# Altium schematic sheet PWR_CPU.SchDoc
size 420 x 297 mm; Scale: 1:1; DocumentType: Схема электрическая принципиальная; SheetNumber: 8; SheetTotal: 32; DocumentTypeShort: Э3; DocumentInvertoryNumber: ㅤ
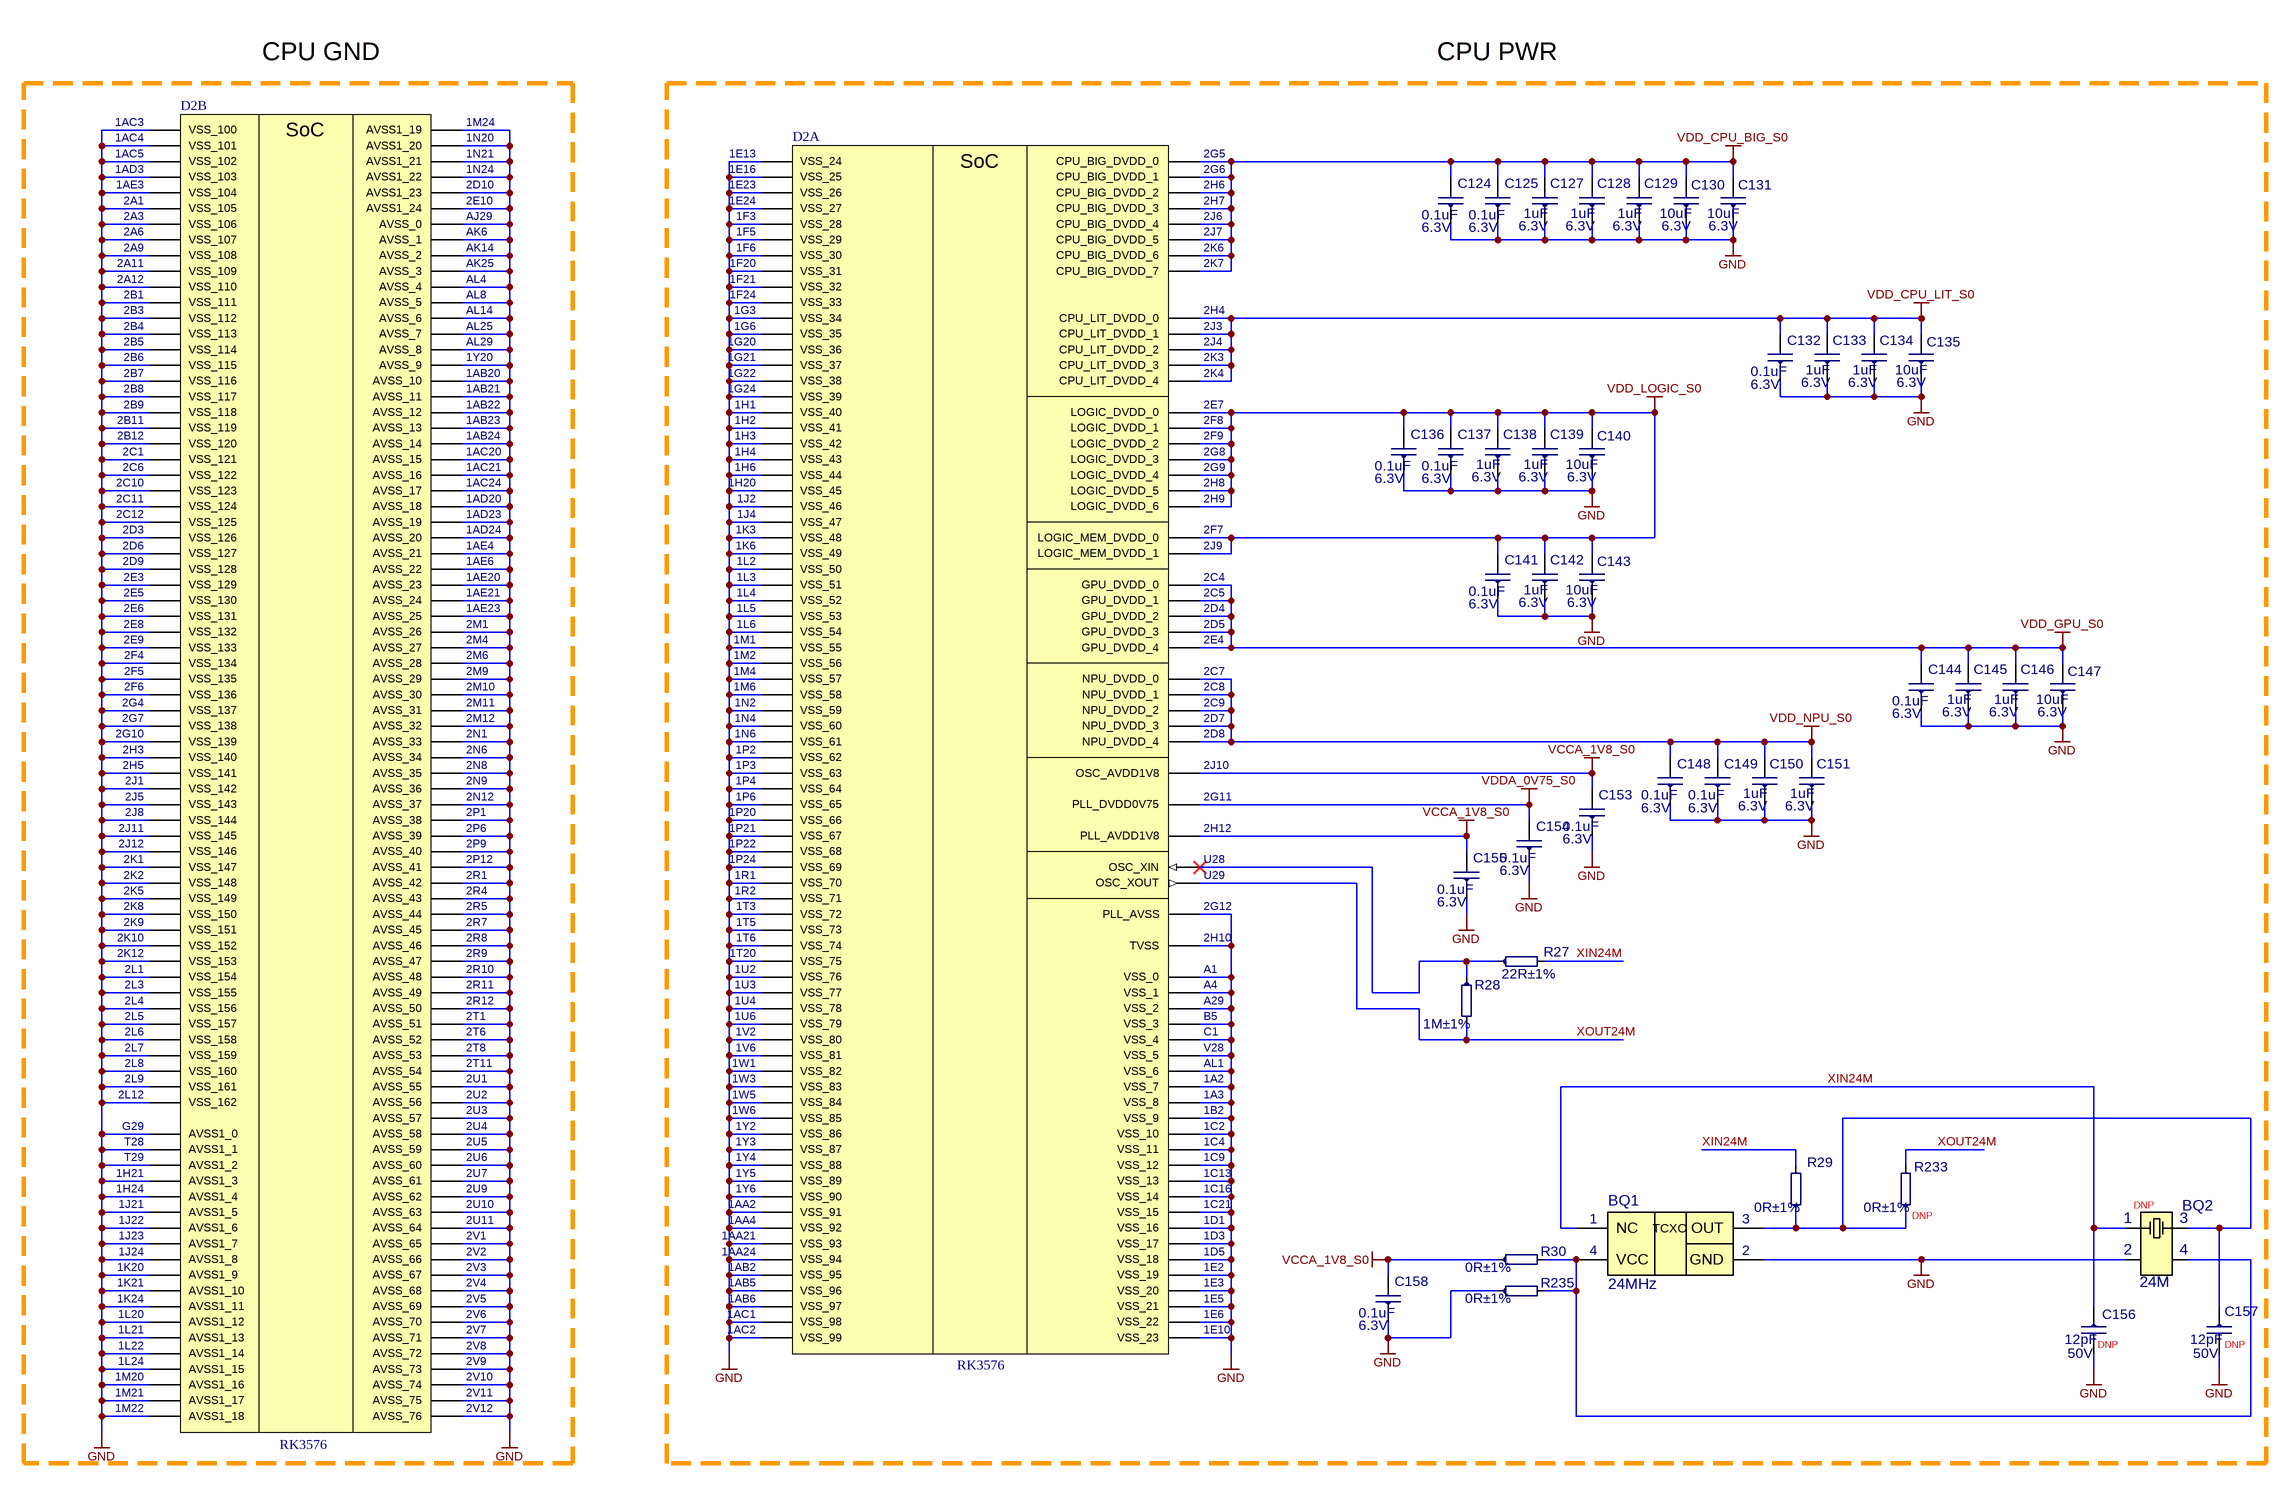
[diagram p0: PWR_CPU.SchDoc]

## Parts
BQ1  24MHz  [TC32S4-24.000-0618NQDTN]
BQ2  24M  [NX3225GA]
C124  0.1uF  Voltage: 6.3V  [C0201]
C125  0.1uF  Voltage: 6.3V  [C0201]
C127  1uF  Voltage: 6.3V  [C0201]
C128  1uF  Voltage: 6.3V  [C0201]
C129  1uF  Voltage: 6.3V  [C0201]
C130  10uF  Voltage: 6.3V  [C0402]
C131  10uF  Voltage: 6.3V  [C0402]
C132  0.1uF  Voltage: 6.3V  [C0201]
C133  1uF  Voltage: 6.3V  [C0201]
C134  1uF  Voltage: 6.3V  [C0201]
C135  10uF  Voltage: 6.3V  [C0402]
C136  0.1uF  Voltage: 6.3V  [C0201]
C137  0.1uF  Voltage: 6.3V  [C0201]
C138  1uF  Voltage: 6.3V  [C0201]
C139  1uF  Voltage: 6.3V  [C0201]
C140  10uF  Voltage: 6.3V  [C0402]
C141  0.1uF  Voltage: 6.3V  [C0201]
C142  1uF  Voltage: 6.3V  [C0201]
C143  10uF  Voltage: 6.3V  [C0402]
C144  0.1uF  Voltage: 6.3V  [C0201]
C145  1uF  Voltage: 6.3V  [C0201]
C146  1uF  Voltage: 6.3V  [C0201]
C147  10uF  Voltage: 6.3V  [C0402]
C148  0.1uF  Voltage: 6.3V  [C0201]
C149  0.1uF  Voltage: 6.3V  [C0201]
C150  1uF  Voltage: 6.3V  [C0201]
C151  1uF  Voltage: 6.3V  [C0201]
C153  0.1uF  Voltage: 6.3V  [C0201]
C154  0.1uF  Voltage: 6.3V  [C0201]
C155  0.1uF  Voltage: 6.3V  [C0201]
C156  12pF  Voltage: 50V  [C0402]
C157  12pF  Voltage: 50V  [C0402]
C158  0.1uF  Voltage: 6.3V  [C0201]
D2  RK3576  [BGAFCCSP698L]  (parts A,B of 7)
R27  22R±1%  [R0402]
R28  1M±1%  [R0402]
R29  0R±1%  [R0402]
R30  0R±1%  [R0402]
R233  0R±1%  [R0402]
R235  0R±1%  [R0402]

## Nets
GND: BQ1.2(GND) BQ2.2 C124.1 C125.1 C127.1 C128.1 C129.1 C130.1 C131.1 C132.1 C133.1 C134.1 C135.1 C136.1 C137.1 C138.1 C139.1 C140.1 C141.1 C142.1 C143.1 C144.1 C145.1 C146.1 C147.1 C148.1 C149.1 C150.1 C151.1 C153.1 C154.1 C155.1 C156.2 C157.2 C158.1 D2.1A2(VSS_7) D2.1A3(VSS_8) D2.1AA2(VSS_91) D2.1AA4(VSS_92) D2.1AA21(VSS_93) D2.1AA24(VSS_94) D2.1AB2(VSS_95) D2.1AB5(VSS_96) D2.1AB6(VSS_97) D2.1AB20(AVSS_10) D2.1AB21(AVSS_11) D2.1AB22(AVSS_12) D2.1AB23(AVSS_13) D2.1AB24(AVSS_14) D2.1AC1(VSS_98) D2.1AC2(VSS_99) D2.1AC3(VSS_100) D2.1AC4(VSS_101) D2.1AC5(VSS_102) D2.1AC20(AVSS_15) D2.1AC21(AVSS_16) D2.1AC24(AVSS_17) D2.1AD3(VSS_103) D2.1AD20(AVSS_18) D2.1AD23(AVSS_19) D2.1AD24(AVSS_20) D2.1AE3(VSS_104) D2.1AE4(AVSS_21) D2.1AE6(AVSS_22) D2.1AE20(AVSS_23) D2.1AE21(AVSS_24) D2.1AE23(AVSS_25) D2.1B2(VSS_9) D2.1C2(VSS_10) D2.1C4(VSS_11) D2.1C9(VSS_12) D2.1C13(VSS_13) D2.1C16(VSS_14) D2.1C21(VSS_15) D2.1D1(VSS_16) D2.1D3(VSS_17) D2.1D5(VSS_18) D2.1E2(VSS_19) D2.1E3(VSS_20) D2.1E5(VSS_21) D2.1E6(VSS_22) D2.1E10(VSS_23) D2.1E13(VSS_24) D2.1E16(VSS_25) D2.1E23(VSS_26) D2.1E24(VSS_27) D2.1F3(VSS_28) D2.1F5(VSS_29) D2.1F6(VSS_30) D2.1F20(VSS_31) D2.1F21(VSS_32) D2.1F24(VSS_33) D2.1G3(VSS_34) D2.1G6(VSS_35) D2.1G20(VSS_36) D2.1G21(VSS_37) D2.1G22(VSS_38) D2.1G24(VSS_39) D2.1H1(VSS_40) D2.1H2(VSS_41) D2.1H3(VSS_42) D2.1H4(VSS_43) D2.1H6(VSS_44) D2.1H20(VSS_45) D2.1H21(AVSS1_3) D2.1H24(AVSS1_4) D2.1J2(VSS_46) D2.1J4(VSS_47) D2.1J21(AVSS1_5) D2.1J22(AVSS1_6) D2.1J23(AVSS1_7) D2.1J24(AVSS1_8) D2.1K3(VSS_48) D2.1K6(VSS_49) D2.1K20(AVSS1_9) D2.1K21(AVSS1_10) D2.1K24(AVSS1_11) D2.1L2(VSS_50) D2.1L3(VSS_51) D2.1L4(VSS_52) D2.1L5(VSS_53) D2.1L6(VSS_54) D2.1L20(AVSS1_12) D2.1L21(AVSS1_13) D2.1L22(AVSS1_14) D2.1L24(AVSS1_15) D2.1M1(VSS_55) D2.1M2(VSS_56) D2.1M4(VSS_57) D2.1M6(VSS_58) D2.1M20(AVSS1_16) D2.1M21(AVSS1_17) D2.1M22(AVSS1_18) D2.1M24(AVSS1_19) D2.1N2(VSS_59) D2.1N4(VSS_60) D2.1N6(VSS_61) D2.1N20(AVSS1_20) D2.1N21(AVSS1_21) D2.1N24(AVSS1_22) D2.1P2(VSS_62) D2.1P3(VSS_63) D2.1P4(VSS_64) D2.1P6(VSS_65) D2.1P20(VSS_66) D2.1P21(VSS_67) D2.1P22(VSS_68) D2.1P24(VSS_69) D2.1R1(VSS_70) D2.1R2(VSS_71) D2.1T3(VSS_72) D2.1T5(VSS_73) D2.1T6(VSS_74) D2.1T20(VSS_75) D2.1U2(VSS_76) D2.1U3(VSS_77) D2.1U4(VSS_78) D2.1U6(VSS_79) D2.1V2(VSS_80) D2.1V6(VSS_81) D2.1W1(VSS_82) D2.1W3(VSS_83) D2.1W5(VSS_84) D2.1W6(VSS_85) D2.1Y2(VSS_86) D2.1Y3(VSS_87) D2.1Y4(VSS_88) D2.1Y5(VSS_89) D2.1Y6(VSS_90) D2.1Y20(AVSS_9) D2.2A1(VSS_105) D2.2A3(VSS_106) D2.2A6(VSS_107) D2.2A9(VSS_108) D2.2A11(VSS_109) D2.2A12(VSS_110) D2.2B1(VSS_111) D2.2B3(VSS_112) D2.2B4(VSS_113) D2.2B5(VSS_114) D2.2B6(VSS_115) D2.2B7(VSS_116) D2.2B8(VSS_117) D2.2B9(VSS_118) D2.2B11(VSS_119) D2.2B12(VSS_120) D2.2C1(VSS_121) D2.2C6(VSS_122) D2.2C10(VSS_123) D2.2C11(VSS_124) D2.2C12(VSS_125) D2.2D3(VSS_126) D2.2D6(VSS_127) D2.2D9(VSS_128) D2.2D10(AVSS1_23) D2.2E3(VSS_129) D2.2E5(VSS_130) D2.2E6(VSS_131) D2.2E8(VSS_132) D2.2E9(VSS_133) D2.2E10(AVSS1_24) D2.2F4(VSS_134) D2.2F5(VSS_135) D2.2F6(VSS_136) D2.2G4(VSS_137) D2.2G7(VSS_138) D2.2G10(VSS_139) D2.2G12(PLL_AVSS) D2.2H3(VSS_140) D2.2H5(VSS_141) D2.2H10(TVSS) D2.2J1(VSS_142) D2.2J5(VSS_143) D2.2J8(VSS_144) D2.2J11(VSS_145) D2.2J12(VSS_146) D2.2K1(VSS_147) D2.2K2(VSS_148) D2.2K5(VSS_149) D2.2K8(VSS_150) D2.2K9(VSS_151) D2.2K10(VSS_152) D2.2K12(VSS_153) D2.2L1(VSS_154) D2.2L3(VSS_155) D2.2L4(VSS_156) D2.2L5(VSS_157) D2.2L6(VSS_158) D2.2L7(VSS_159) D2.2L8(VSS_160) D2.2L9(VSS_161) D2.2L12(VSS_162) D2.2M1(AVSS_26) D2.2M4(AVSS_27) D2.2M6(AVSS_28) D2.2M9(AVSS_29) D2.2M10(AVSS_30) D2.2M11(AVSS_31) D2.2M12(AVSS_32) D2.2N1(AVSS_33) D2.2N6(AVSS_34) D2.2N8(AVSS_35) D2.2N9(AVSS_36) D2.2N12(AVSS_37) D2.2P1(AVSS_38) D2.2P6(AVSS_39) D2.2P9(AVSS_40) D2.2P12(AVSS_41) D2.2R1(AVSS_42) D2.2R4(AVSS_43) D2.2R5(AVSS_44) D2.2R7(AVSS_45) D2.2R8(AVSS_46) D2.2R9(AVSS_47) D2.2R10(AVSS_48) D2.2R11(AVSS_49) D2.2R12(AVSS_50) D2.2T1(AVSS_51) D2.2T6(AVSS_52) D2.2T8(AVSS_53) D2.2T11(AVSS_54) D2.2U1(AVSS_55) D2.2U2(AVSS_56) D2.2U3(AVSS_57) D2.2U4(AVSS_58) D2.2U5(AVSS_59) D2.2U6(AVSS_60) D2.2U7(AVSS_61) D2.2U9(AVSS_62) D2.2U10(AVSS_63) D2.2U11(AVSS_64) D2.2V1(AVSS_65) D2.2V2(AVSS_66) D2.2V3(AVSS_67) D2.2V4(AVSS_68) D2.2V5(AVSS_69) D2.2V6(AVSS_70) D2.2V7(AVSS_71) D2.2V8(AVSS_72) D2.2V9(AVSS_73) D2.2V10(AVSS_74) D2.2V11(AVSS_75) D2.2V12(AVSS_76) D2.A1(VSS_0) D2.A4(VSS_1) D2.A29(VSS_2) D2.AJ29(AVSS_0) D2.AK6(AVSS_1) D2.AK14(AVSS_2) D2.AK25(AVSS_3) D2.AL1(VSS_6) D2.AL4(AVSS_4) D2.AL8(AVSS_5) D2.AL14(AVSS_6) D2.AL25(AVSS_7) D2.AL29(AVSS_8) D2.B5(VSS_3) D2.C1(VSS_4) D2.G29(AVSS1_0) D2.T28(AVSS1_1) D2.T29(AVSS1_2) D2.V28(VSS_5) R235.1
VCCA_1V8_S0: C153.2 C155.2 C158.2 D2.2H12(PLL_AVDD1V8) D2.2J10(OSC_AVDD1V8) R30.1
VDD_CPU_BIG_S0: C124.2 C125.2 C127.2 C128.2 C129.2 C130.2 C131.2 D2.2G5(CPU_BIG_DVDD_0) D2.2G6(CPU_BIG_DVDD_1) D2.2H6(CPU_BIG_DVDD_2) D2.2H7(CPU_BIG_DVDD_3) D2.2J6(CPU_BIG_DVDD_4) D2.2J7(CPU_BIG_DVDD_5) D2.2K6(CPU_BIG_DVDD_6) D2.2K7(CPU_BIG_DVDD_7)
VDD_CPU_LIT_S0: C132.2 C133.2 C134.2 C135.2 D2.2H4(CPU_LIT_DVDD_0) D2.2J3(CPU_LIT_DVDD_1) D2.2J4(CPU_LIT_DVDD_2) D2.2K3(CPU_LIT_DVDD_3) D2.2K4(CPU_LIT_DVDD_4)
VDD_GPU_S0: C144.2 C145.2 C146.2 C147.2 D2.2C4(GPU_DVDD_0) D2.2C5(GPU_DVDD_1) D2.2D4(GPU_DVDD_2) D2.2D5(GPU_DVDD_3) D2.2E4(GPU_DVDD_4)
VDD_LOGIC_S0: C136.2 C137.2 C138.2 C139.2 C140.2 C141.2 C142.2 C143.2 D2.2E7(LOGIC_DVDD_0) D2.2F7(LOGIC_MEM_DVDD_0) D2.2F8(LOGIC_DVDD_1) D2.2F9(LOGIC_DVDD_2) D2.2G8(LOGIC_DVDD_3) D2.2G9(LOGIC_DVDD_4) D2.2H8(LOGIC_DVDD_5) D2.2H9(LOGIC_DVDD_6) D2.2J9(LOGIC_MEM_DVDD_1)
VDD_NPU_S0: C148.2 C149.2 C150.2 C151.2 D2.2C7(NPU_DVDD_0) D2.2C8(NPU_DVDD_1) D2.2C9(NPU_DVDD_2) D2.2D7(NPU_DVDD_3) D2.2D8(NPU_DVDD_4)
VDDA_0V75_S0: C154.2 D2.2G11(PLL_DVDD0V75)
XIN24M: BQ1.1(NC) BQ2.1 C156.1 R27.2 R29.2
XOUT24M: D2.U29(OSC_XOUT) R28.2 R233.2
NetBQ1_3: BQ1.3(OUT) BQ2.3 C157.1 R29.1 R233.1
NetBQ1_4: BQ1.4(VCC) BQ2.4 R30.2 R235.2
NetD2_U28: D2.U28(OSC_XIN) R27.1 R28.1

## Notes on the sheet
- CPU GND
- CPU PWR
- (near BQ2) DNP
- (near R233) DNP
- (near C156) DNP
- (near C157) DNP
- Подп. и дата
- Инв. № дубл.
- Взам. инв. №
- Инв. № подл.
- Изм.
- Лист
- № докум.
- Подп.
- Дата
- Копировал
- Формат А3
- (in symbol RK3576, part A) SoC
- (in symbol RK3576, part B) SoC
- (in symbol TC32S4-24.000-0618NQDTN) TCXO

## Library data of the parts
BQ1 = TC32S4-24.000-0618NQDTN: TCXO SMD 3.2x2.5, Clipped Sine, 1.8V; Manufacturer: HCI; Check: False; Analogs: ECS-TXO-3225MV-240-TR; Part Number: TC32S4-24.000-0618NQDTN; Value: 24MHz; NameFromManufacturer: TC32S4-24.000-0618NQDTN
BQ2 = NX3225GA-24M-18pF-10ppm: Part Number: 3225-24-18-10-10/4B; Manufacturer: Liming; Place: S; Tolerance: 10ppm; Check: False; Value: 24M; NameFromManufacturer: 3225-24-18-10-10/4B; ComponentLink1Description: DATASHEET; ComponentLink1URL: https://www.raltron.com/wp-content/uploads/2019/07/RH100_SERIES-July-2019.pdf; Last changed: 27.10.2022
C124 C125 C132 C136 C137 C141 C144 C148 C149 C153-C155 C158 = 0201-X5R-6.3V-0.1uF±10%: Manufacturer: Yageo; NameFromManufacturer: CC0201KRX5R5BB104; Dielectric: X5R; Place: *); Tolerance: 10%; Check: False; Case: C0201; Part Number: 0201-X5R-6.3V-0.1uF±10%; Value: 0.1uF; Temperature: -55°C~85°C; ComponentLink2Description: Link to datasheet; ComponentLink1Description: DATASHEET; ComponentLink2URL: https://www.terraelectronica.ru/product/1020032; ComponentLink1URL: Datasheets/capacitors/UPY-GPHC_X5R_4V-to-50V_27.pdf; Last changed: 27.10.2022
C127-C129 C133 C134 C138 C139 C142 C145 C146 C150 C151 = 0201-X5R-6.3V-1uF±20%: Manufacturer: Murata Electronics; NameFromManufacturer: GRM033R60J105MEA2D; Dielectric: X5R; Place: *); Tolerance: 20%; Check: False; Case: C0201; Part Number: 0201-X5R-6.3V-1uF±20%; Value: 1uF; Temperature: -55°C~85°C; ComponentLink2Description: Link to datasheet; ComponentLink1Description: DATASHEET; ComponentLink2URL: https://www.terraelectronica.ru/product/1209278; ComponentLink1URL: Datasheets/capacitors/GRM033R60J105MEA2-61A.pdf; Last changed: 27.10.2022
C130 C131 C135 C140 C143 C147 = 0402-X5R-6.3V-10uF±20%: Manufacturer: Yageo; NameFromManufacturer: CC0402MRX5R5BB106; Dielectric: X5R; Place: *); Tolerance: 20%; Check: False; Case: C0402; Part Number: 0402-X5R-6.3V-10uF±20%; Value: 10uF; Temperature: -55°C~125°C; ComponentLink2Description: Link to datasheet; ComponentLink1Description: DATASHEET; ComponentLink2URL: https://ru.mouser.com/ProductDetail/YAGEO/CC0402MRX5R5BB106?qs=%2Fha2pyFadujQAk9rG2cgJj8l7IbODD3KVaDjvxAcKzu9LtlLnRlq6Q%3D%3D; ComponentLink1URL: Datasheets/capacitors/UPY-GPHC_X5R_4V-to-50V_27.pdf; Last changed: 27.10.2022
C156 C157 = 0402-NP0-50V-12pF±5%: Manufacturer: Murata Electronics; NameFromManufacturer: GRM1555C1H120JA01D; Dielectric: NP0; Place: *); Tolerance: 5%; Check: False; Case: C0402; Part Number: 0402-NP0-50V-12pF±5%; Value: 12pF; Temperature: -55°C~125°C; ComponentLink2Description: Link to datasheet; ComponentLink1Description: DATASHEET; ComponentLink2URL: https://www.terraelectronica.ru/pdf/show?pdf_file=http%253A%252F%252Fwww.farnell.com%252Fdatasheets%252F2048662.pdf; ComponentLink1URL: Datasheets/capacitors/GRM1555C1H120JA01-01A.pdf; Last changed: 27.10.2022
D2 = RK3576: SoC 4xCortex-A72@2.2Ghz+4xCortex-A53@2Ghz, LPDDR4/4X/5/5X, SDIO/eMMC/UFS/FSPI, BGA 16.1x17.2x1.0mm; Manufacturer: Rockship; Place: *); Check: False; Part Number: RK3576; Temperature: -40°C~85°C; Value: RK3576; ComponentLink1Description: DATASHEET; NameFromManufacturer: RK3576; ComponentLink1URL: https://wiki.friendlyelec.com/wiki/images/b/bf/Rockchip_RK3576_Datasheet_V1.5-20241216.pdf; Last changed: 06.01.2026
R27 = 0402-0.0625W-22R-100ppm±1%: Chip Resistor 0402 22Ω ±1% 50V ±100ppm/℃ Thick Film; NameFromManufacturer: RC0402FR-0722RL; Manufacturer: Yageo; Place: *); Value: 22R; Check: False; Case: R0402; Part Number: 0402-0.0625W-22R-100ppm±1%; Tolerance: 1%; Temperature: -55°C~155°C; ComponentLink1Description: DATASHEET; ComponentLink1URL: https://www.yageo.com/upload/media/product/productsearch/datasheet/rchip/PYu-RC_Group_51_RoHS_L_11.pdf; Datasheet: Datasheets/resistors/PYu-RC_Group_51_RoHS_L_11.pdf; Last changed: 27.10.2022
R28 = 0402-0.0625W-1M-100ppm±1%: Chip Resistor 0402 1MΩ ±1% 50V ±100ppm/℃ Thick Film; NameFromManufacturer: RC0402FR-071ML; Manufacturer: Yageo; Place: *); Value: 1M; Check: False; Case: R0402; Part Number: 0402-0.0625W-1M-100ppm±1%; Tolerance: 1%; Temperature: -55°C~155°C; ComponentLink1Description: DATASHEET; ComponentLink1URL: https://www.yageo.com/upload/media/product/productsearch/datasheet/rchip/PYu-RC_Group_51_RoHS_L_11.pdf; Datasheet: Datasheets/resistors/PYu-RC_Group_51_RoHS_L_11.pdf; Last changed: 27.10.2022
R29 R30 R233 R235 = 0402-0.0625W-0R-100ppm±1%: Chip Resistor 0402 0Ω ±1% 50V ±100ppm/℃ Thick Film; NameFromManufacturer: RC0402FR-070RL; Manufacturer: Yageo; Place: *); Value: 0R; Check: False; Case: R0402; Part Number: 0402-0.0625W-0R-100ppm±1%; Tolerance: 1%; Temperature: -55°C~155°C; ComponentLink1Description: DATASHEET; ComponentLink1URL: https://www.chipdip.ru/product0/8000617426?ysclid=l7og5x0plo427794326; Datasheet: Datasheets/resistors/DOC012445956.pdf; Last changed: 27.10.2022